# Altium project PD_SMARTKEY_EMN-EVAN_V2.0.PrjPcb
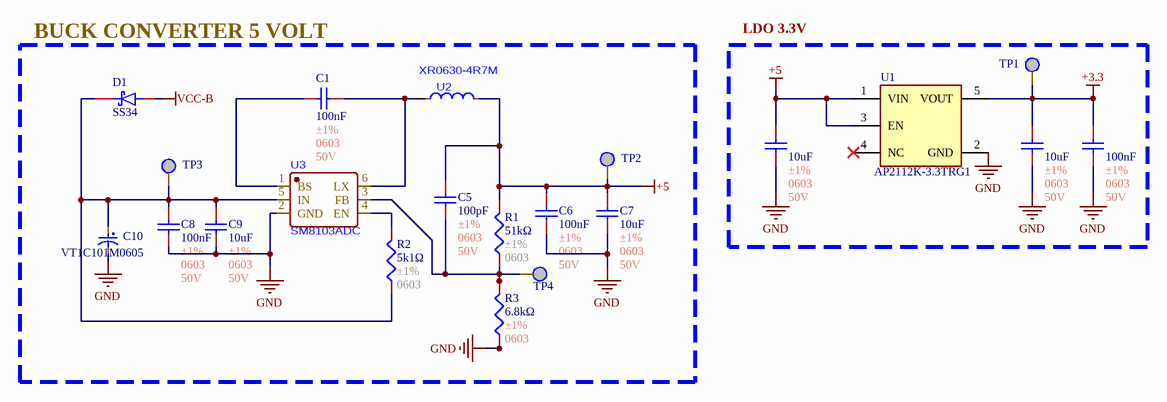
[diagram p0: Voltage Source.SchDoc]
4 sheets, 116 parts. Net scope: global (net labels, ports and power ports of the same name join across sheets).
Board file: PD_SMARTKEY_EMN-EVAN_V2.0.PcbDoc
Sheets:
  Voltage Source.SchDoc
  Micro Controller.SchDoc
  Peripheral.SchDoc
  Connector.SchDoc

## Sheet Voltage Source.SchDoc
size A4; SheetNumber: 3; SheetTotal: 6; ProjectTitle: PD_SMARTKEY_EMN-EVAN_V2

### Parts
C1  100nF  Tolerance: ±1%  Package: 0603  Voltage Rating: 50V  [C0603]
C2  10uF  Tolerance: ±1%  Package: 0603  Voltage Rating: 50V  [C0603]
C3  10uF  Tolerance: ±1%  Package: 0603  Voltage Rating: 50V  [C0603]
C4  100nF  Tolerance: ±1%  Package: 0603  Voltage Rating: 50V  [C0603]
C5  100pF  Tolerance: ±1%  Package: 0603  Voltage Rating: 50V  [C0603]
C6  100nF  Tolerance: ±1%  Package: 0603  Voltage Rating: 50V  [C0603]
C7  10uF  Tolerance: ±1%  Package: 0603  Voltage Rating: 50V  [C0603]
C8  100nF  Tolerance: ±1%  Package: 0603  Voltage Rating: 50V  [C0603]
C9  10uF  Tolerance: ±1%  Package: 0603  Voltage Rating: 50V  [C0603]
C10  VT1C101M0605  [C_100uF_16V_Aluminum]
D1  SS34  [SS34]
R1  51kΩ  Tolerance: ±1%  Package: 0603  [R0603]
R2  5k1Ω  Tolerance: ±1%  Package: 0603  [R0603]
R3  6.8kΩ  Tolerance: ±1%  Package: 0603  [R0603]
TP1  TP  [TP]  (value not drawn)
TP2  TP  [TP]  (value not drawn)
TP3  TP  [TP]  (value not drawn)
TP4  TP  [TP]  (value not drawn)
U1  AP2112K-3.3TRG1  [SOT23-5]
U2  XR0630-4R7M  [SMD,7x6.6mm]
U3  SM8103ADC  [TSOT-23-6]

### Blocks framed on the sheet
BUCK CONVERTER 5 VOLT: C1 C5-C10 D1 R1-R3 TP2-TP4 U2 U3
LDO 3.3V: C2-C4 TP1 U1

### Nets
+3.3: C3.1 C4.1 TP1.1 U1.5(VOUT)
+5: C2.1 C5.1 C6.1 C7.1 R1.2 TP2.1 U1.1(VIN) U1.3(EN) U2.2(F)
GND: C2.2 C3.2 C4.2 C6.2 C7.2 C8.2 C9.2 C10.2 R3.1 U1.2(GND) U3.2(GND)
VCC-B: D1.2
NetC1_1: C1.1 U2.1(S) U3.6(LX)
NetC1_2: C1.2 U3.1(BS)
NetC5_2: C5.2 R1.1 R3.2 TP4.1 U3.3(FB)
NetC8_1: C8.1 C9.1 C10.1 D1.1 R2.1 TP3.1 U3.5(IN)
NetR2_2: R2.2 U3.4(EN)

Not connected (* = marked no-connect by the designer): U1 4(NC)*

### Notes on the sheet
- Author:
- Title:
- Size:
- A4
- Project:
- Approved:
- Revision:
- Modified Date:
- CONFIDENTIAL
- Date:
- SW Version:

### Library data of the parts
C1 C6 C8 = C0603_100nF_±1%: Manufacturer: YAGEO; Mfr. Part #: CC0402FRNPO9BN100; LCSC Part #: C513681; Link: https://www.lcsc.com/product-detail/C513681.html?s_z=n_capital%2520yageo%252010pF%25200402; Capacitance: 100nF
C2 C3 = C0603_10uF_±1%: 50V 10pF NP0 ±1% 0402 Multilayer Ceramic Capacitors MLCC - SMD/SMT ROHS; Manufacturer: YAGEO; Mfr. Part #: CC0402FRNPO9BN100; LCSC Part #: C513681; Link: https://www.lcsc.com/product-detail/C513681.html?s_z=n_capital%2520yageo%252010pF%25200402; Capacitance: 10uF
C4 = C0603_100nF_±1%: 50V 10pF NP0 ±1% 0402 Multilayer Ceramic Capacitors MLCC - SMD/SMT ROHS; Manufacturer: YAGEO; Mfr. Part #: CC0402FRNPO9BN100; LCSC Part #: C513681; Link: https://www.lcsc.com/product-detail/C513681.html?s_z=n_capital%2520yageo%252010pF%25200402; Capacitance: 100nF
C5 = C0603_100pF_±1%: Manufacturer: YAGEO; Mfr. Part #: CC0402FRNPO9BN100; LCSC Part #: C513681; Link: https://www.lcsc.com/product-detail/C513681.html?s_z=n_capital%2520yageo%252010pF%25200402; Capacitance: 100pF
C7 C9 = C0603_10uF_±1%: Manufacturer: YAGEO; Mfr. Part #: CC0402FRNPO9BN100; LCSC Part #: C513681; Link: https://www.lcsc.com/product-detail/C513681.html?s_z=n_capital%2520yageo%252010pF%25200402; Capacitance: 10uF
C10 = C_100uF_16V_aluminum: 100uF 16V ±20% 63mA@120Hz SMD,D6.3xL5.4mm Aluminum Electrolytic Capacitors RoHS; Manufacturer: ROQANG; Key Attributes: CAP ALUM 100uF ±20% 16V SMD; Mfr. Part #: VT1C101M0605; LCSC Part #: C90273; Package: SMD,D6.3xL5.4mm; Link: https://www.lcsc.com/product-detail/C90273.html?s_z=n_capital%2520100uf%2520aluminum
D1 = SS34: 40V Independent 3A 550mV@3A SMA(DO-214AC) Schottky Diodes ROHS; Manufacturer: MDD(Microdiode Semiconductor); Mfr. Part #: SS34; LCSC Part #: C8678; Package: SMA(DO-214AC); Voltage - DC Reverse(Vr): 40V; Current - Rectified: 3A; Link: https://www.lcsc.com/product-detail/C8678.html?s_z=n_SS34
R1 = R0603_51kΩ_±1%: 100mW Thick Film Resistor 75V ±100ppm/℃ ±1% 51kΩ 0603 Chip Resistor - Surface Mount ROHS; Manufacturer: FOJAN; Mfr. Part #: FRC0603F5101TS; Key Attributes: RES 5.1kΩ ±1% 100mW 0603; LCSC Part #: C2907044; Link: https://www.lcsc.com/product-detail/C2907044.html?s_z=n_5k1%25200603; Resistance: 51kΩ
R2 = R0603_5k1Ω_±1%: 100mW Thick Film Resistor 75V ±100ppm/℃ ±1% 5.1kΩ 0603 Chip Resistor - Surface Mount ROHS; Manufacturer: FOJAN; Mfr. Part #: FRC0603F5101TS; Key Attributes: RES 5.1kΩ ±1% 100mW 0603; LCSC Part #: C2907044; Link: https://www.lcsc.com/product-detail/C2907044.html?s_z=n_5k1%25200603; Resistance: 5k1Ω
R3 = R0603_6.8kΩ_±1%_1: 6.8k; Manufacturer: YAGEO; Mfr. Part #: RC0402FR-0710RL; LCSC Part #: C138066; Resistance: 6.8kΩ; Link: https://www.lcsc.com/product-detail/C138066.html?s_z=n_resistor%25200402%252010R
U1 = AP2112K-3.3TRG1: Linear Voltage Regulator IC Positive Fixed 1 Output 600mA SOT23-5; MF: Diodes Inc.; Value: *; Purchase-URL: https://pricing.snapeda.com/search/part/AP2112K-3.3TRG1/?ref=eda; Package: SOT-753 Diodes Inc.; Availability: In Stock; Check_prices: https://www.snapeda.com/parts/AP2112K-3.3TRG1/Diodes+Inc./view-part/?ref=eda; Price: None; SnapEDA_Link: https://www.snapeda.com/parts/AP2112K-3.3TRG1/Diodes+Inc./view-part/?ref=snap; MP: AP2112K-3.3TRG1
U2 = FIXED IND 4.7uH 6A 33mΩ SMD,0630: Manufacturer: XR; MPN: XR0630-4R7M; LCSC Part #: C5307631; Packaging: SMD,7x6.6mm; Link: https://www.lcsc.com/product-detail/C5307631.html?s_z=n_q_t_INDUCTOR%25200630&spm=wm.fly.bg.0.xh___wm.ssy.tc.0.tz&lcsc_vid=FFlaVlZURFlbX1EAE1lbUlZfQwdeBlBRQ1VZBFdQQwUxVlNeRlRfU1ZRQlNZXzsOAxUeFF5JWBYZEEoKFBINSQcJGk4eFQsCAgIaSgADAwAHC0slQ1ZXV1NWWQkaCgg%3D
U3 = SM8103ADC: High Efficiency, 3.0A, 18V Input Synchronous Step Down Regulator; Manufacturer: Silergy; MPN: SM8103ADC; LCSC Part #: C479070; Packaging: TSOT-23-6; Link: https://www.lcsc.com/product-detail/C479070.html?s_z=s_p_SM8103ADC&spm=wm.fly.bg.0.xh&lcsc_vid=FFlaVlZURFlbX1EAE1lbUlZfQwdeBlBRQ1VZBFdQQwUxVlNeRlReUVRTQVFeUDsOAxUeFF5JWBYZEEoKFBINSQcJGk4dAgUUFAk%3D

## Sheet Micro Controller.SchDoc
size A4; SheetNumber: 4; SheetTotal: 6; ProjectTitle: PD_SMARTKEY_EMN-EVAN_V2
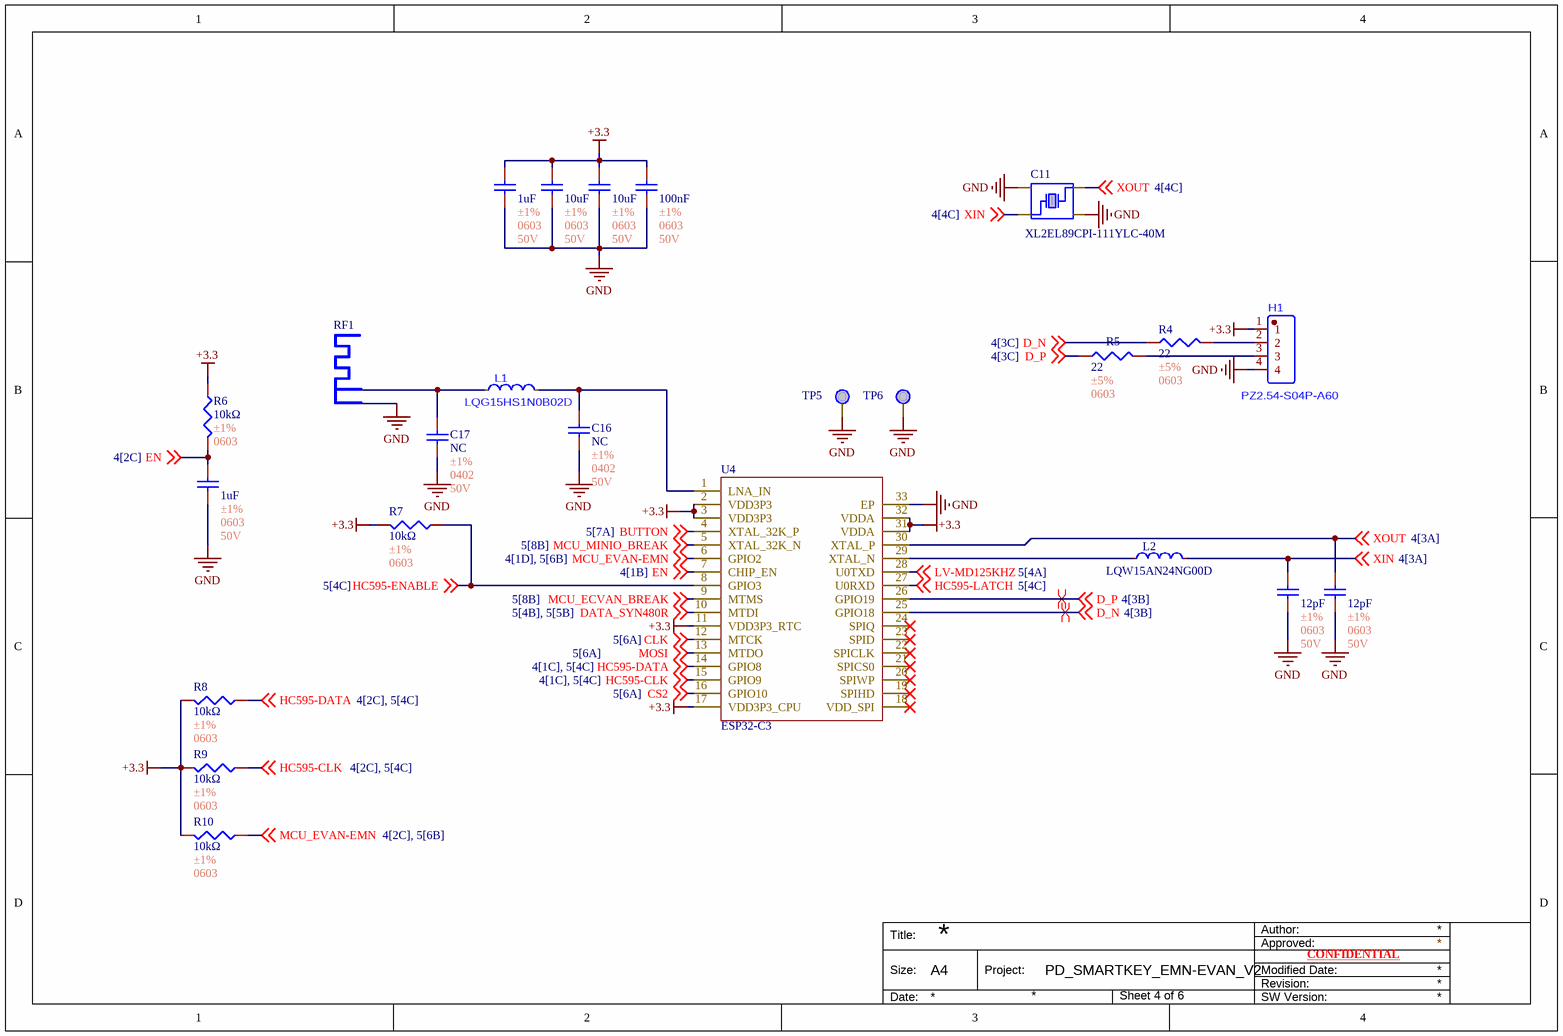
[diagram p1: Micro Controller.SchDoc]

### Parts
C11  XL2EL89CPI-111YLC-40M  [XL2EL89CPI-111YLC-40M]
C12  1uF  Tolerance: ±1%  Package: 0603  Voltage Rating: 50V  [C0603]
C13  10uF  Tolerance: ±1%  Package: 0603  Voltage Rating: 50V  [C0603]
C14  10uF  Tolerance: ±1%  Package: 0603  Voltage Rating: 50V  [C0603]
C15  100nF  Tolerance: ±1%  Package: 0603  Voltage Rating: 50V  [C0603]
C16  NC  Tolerance: ±1%  Package: 0402  Voltage Rating: 50V  [C0402]
C17  NC  Tolerance: ±1%  Package: 0402  Voltage Rating: 50V  [C0402]
C18  1uF  Tolerance: ±1%  Package: 0603  Voltage Rating: 50V  [C0603]
C19  12pF  Tolerance: ±1%  Package: 0603  Voltage Rating: 50V  [C0603]
C20  12pF  Tolerance: ±1%  Package: 0603  Voltage Rating: 50V  [C0603]
H1  PZ2.54-S04P-A60  [J_4P_XH2.54]
L1  LQG15HS1N0B02D  [L0402_1nH]
L2  LQW15AN24NG00D  [LQW15AN24NG00D]
R4  22  Tolerance: ±5%  Package: 0603  [R0603]
R5  22  Tolerance: ±5%  Package: 0603  [R0603]
R6  10kΩ  Tolerance: ±1%  Package: 0603  [R0603]
R7  10kΩ  Tolerance: ±1%  Package: 0603  [R0603]
R8  10kΩ  Tolerance: ±1%  Package: 0603  [R0603]
R9  10kΩ  Tolerance: ±1%  Package: 0603  [R0603]
R10  10kΩ  Tolerance: ±1%  Package: 0603  [R0603]
RF1  (no value)  [2.4GHZ-50OHMS_v1.1]
TP5  TP  [TP]  (value not drawn)
TP6  TP  [TP]  (value not drawn)
U4  ESP32-C3  [ESP32-C3]

### Nets
+3.3: C12.1 C13.1 C14.1 C15.1 H1.1 R6.1 R7.2 R8.2 R9.2 R10.2 U4.2(VDD3P3) U4.3(VDD3P3) U4.11(VDD3P3_RTC) U4.17(VDD3P3_CPU) U4.31(VDDA) U4.32(VDDA)
GND: C11.2 C11.4 C12.2 C13.2 C14.2 C15.2 C16.2 C17.2 C18.2 C19.2 C20.2 H1.4 RF1.2 TP5.1 TP6.1 U4.33(EP)
BUTTON: U4.4(XTAL_32K_P) ; off-sheet BUTTON
CLK: U4.12(MTCK) ; off-sheet CLK
CS2: U4.16(GPIO10) ; off-sheet CS2
D_N: R4.1 U4.25(GPIO18) ; off-sheet D_N
D_P: R5.1 U4.26(GPIO19) ; off-sheet D_P
DATA_SYN480R: U4.10(MTDI) ; off-sheet DATA_SYN480R
EN: C18.1 R6.2 U4.7(CHIP_EN) ; off-sheet EN
HC595-CLK: R9.1 U4.15(GPIO9) ; off-sheet HC595-CLK
HC595-DATA: R8.1 U4.14(GPIO8) ; off-sheet HC595-DATA
HC595-ENABLE: R7.1 U4.8(GPIO3) ; off-sheet HC595-ENABLE
HC595-LATCH: U4.27(U0RXD) ; off-sheet HC595-LATCH
LV-MD125KHZ: U4.28(U0TXD) ; off-sheet LV-MD125KHZ
MCU_ECVAN_BREAK: U4.9(MTMS) ; off-sheet MCU_ECVAN_BREAK
MCU_EVAN-EMN: R10.1 U4.6(GPIO2) ; off-sheet MCU_EVAN-EMN
MCU_MINIO_BREAK: U4.5(XTAL_32K_N) ; off-sheet MCU_MINIO_BREAK
MOSI: U4.13(MTDO) ; off-sheet MOSI
XIN: C11.1 C19.1 L2.2 ; off-sheet XIN
XOUT: C11.3 C20.1 U4.30(XTAL_P) ; off-sheet XOUT
NetC16_1: C16.1 L1.2 U4.1(LNA_IN)
NetC17_1: C17.1 L1.1 RF1.1
NetH1_2: H1.2 R4.2
NetH1_3: H1.3 R5.2
NetL2_1: L2.1 U4.29(XTAL_N)

Not connected (* = marked no-connect by the designer): U4 18(VDD_SPI)* 19(SPIHD)* 20(SPIWP)* 21(SPICS0)* 22(SPICLK)* 23(SPID)* 24(SPIQ)*

### Layout directives
differential pair: D_N, D_P

### Notes on the sheet
- Author:
- Title:
- Size:
- A4
- Project:
- Approved:
- Revision:
- Modified Date:
- CONFIDENTIAL
- Date:
- SW Version:

### Library data of the parts
C11 = XL2EL89CPI-111YLC-40M: Crystal Oscillator 15pF SMD3225-4P Crystals RoHS; Manufacturer: YXC Crystal Oscillators; Mfr. Part #: XL2EL89CPI-111YLC-40M; LCSC Part #: C5444549; Package: SMD3225-4P; Link: https://www.lcsc.com/product-detail/C5444549.html?s_z=n_oscillator; Key Attributes: Crystal Oscillator 15pF SMD3225-4P Crystals RoHS
C12 C18 = C0603_1uF_±1%: 50V 10pF NP0 ±1% 0402 Multilayer Ceramic Capacitors MLCC - SMD/SMT ROHS; Manufacturer: YAGEO; Mfr. Part #: CC0402FRNPO9BN100; LCSC Part #: C513681; Link: https://www.lcsc.com/product-detail/C513681.html?s_z=n_capital%2520yageo%252010pF%25200402; Capacitance: 1uF
C13 C14 = C0603_10uF_±1%: as C2 on sheet Voltage Source; LCSC Part #: C513681; Link: https://www.lcsc.com/product-detail/C513681.html?s_z=n_capital%2520yageo%252010pF%25200402; Capacitance: 10uF
C15 = C0603_100nF_±1%: as C4 on sheet Voltage Source; LCSC Part #: C513681; Link: https://www.lcsc.com/product-detail/C513681.html?s_z=n_capital%2520yageo%252010pF%25200402; Capacitance: 100nF
C16 C17 = C0402_NC_±1%: Manufacturer: YAGEO; Mfr. Part #: CC0402FRNPO9BN100; Capacitance: 1uF; LCSC Part #: C513681; Link: https://www.lcsc.com/product-detail/C513681.html?s_z=n_capital%2520yageo%252010pF%25200402
C19 C20 = C0603_12pF_±1%: 50V 10pF NP0 ±1% 0402 Multilayer Ceramic Capacitors MLCC - SMD/SMT ROHS; Manufacturer: YAGEO; Mfr. Part #: CC0402FRNPO9BN100; LCSC Part #: C513681; Link: https://www.lcsc.com/product-detail/C513681.html?s_z=n_capital%2520yageo%252010pF%25200402; Capacitance: 12pF
H1 = J_4P_XH2.54: 1kV 1 2.54mm Pin Header 3A 2.5mm Through Hole 6mm -40℃~+105℃ 3mm Gold 4P Black 1x4P Through Hole,P=2.54mm Headers, Male Pins RoHS; Manufacturer: JXTCONN; MPN: PZ2.54-S04P-A60; LCSC Part #: C42431795; Packaging: Through Hole,P=2.54mm; Link: https://www.lcsc.com/product-detail/C42431795.html?s_z=n_q_t_header%25204%2520p&spm=wm.fly.bg.0.xh___wm.ssy.tc.0.tz&lcsc_vid=FlRcBlcDRFNZAlJQT1RZBVJSEVFcX11eRVQPBFEHFgAxVlNeQVVcV1RRRlFeUzsOAxUeFF5JWBYZEEoKFBINSQcJGk4dAgUUFAk%3D
L1 = L0402_1nH: FIXED IND 1nH 1A 70mΩ 0402; Manufacturer: muRata; MPN: LQG15HS1N0B02D; LCSC Part #: C162538; Packaging: 0402; Link: https://www.lcsc.com/product-detail/C162538.html?s_z=n_q_0402%2520inductor%25201nH&spm=wm.fly.bg.1.xh&lcsc_vid=FFlaVlZURFlbX1EAE1lbUlZfQwdeBlBRQ1VZBFdQQwUxVlNeQ1FfVlBVRFlZVjsOAxUeFF5JWBYZEEoKFBINSQcJGk4NBhADEA4cHktXRllfSQwSGg0%3D
L2 = LQW15AN24NG00D: FIXED IND 24nH 280mA 520mΩ 0402; Manufacturer: muRata; Mfr. Part #: LQW15AN24NG00D; LCSC Part #: C167472; Package: 0402; Link: https://www.lcsc.com/product-detail/C167472.html?s_z=n_q_inductor%252024nH%25200402&spm=wm.fly.bg.0.xh&lcsc_vid=FlRcBlcDRFNZAlJQT1RZBVJSEVFcX11eRVQPBFEHFgAxVlNeQVRfUFJVQVNZUzsOAxUeFF5JWBYZEEoKFBINSQcJGk4eFQsCAgIaSgADAwAHC0slRlhdU1RSWQkaCgg%3D
R4 R5 = R0603_0Ω_±5%: 100mW Thick Film Resistor 75V ±5% 0Ω 0603 Chip Resistor - Surface Mount ROHS; Manufacturer: YAGEO; Mfr. Part #: RC0603JR-070RL; Key Attributes: RES 0Ω ±5% 100mW 0603; LCSC Part #: C95177; Resistance: 0Ω; Link: https://www.lcsc.com/product-detail/C138066.html?s_z=n_resistor%25200402%252010R
R6-R10 = R0603_10kΩ_±1%: 62.5mW Thick Film Resistor 50V ±1% ±200ppm/℃ 10Ω 0402 Chip Resistor - Surface Mount ROHS; Manufacturer: YAGEO; Mfr. Part #: RC0402FR-0710RL; LCSC Part #: C138066; Resistance: 10kΩ; Link: https://www.lcsc.com/product-detail/C138066.html?s_z=n_resistor%25200402%252010R
RF1 = Antenna
U4 = ESP32-C3: Others 160MHz QFN-32-EP(5x5) RF Transceiver Modules and Modems RoHS; Manufacturer: ESPRESSIF; LCSC Part #: C2838500; Package: QFN-32-EP(5x5); Link: https://www.lcsc.com/product-detail/C2838500.html?s_z=n_ESP32%2520C3; MPN: ESP32-C3

## Sheet Peripheral.SchDoc
size A3; SheetNumber: 5; SheetTotal: 6; ProjectTitle: PD_SMARTKEY_EMN-EVAN_V2
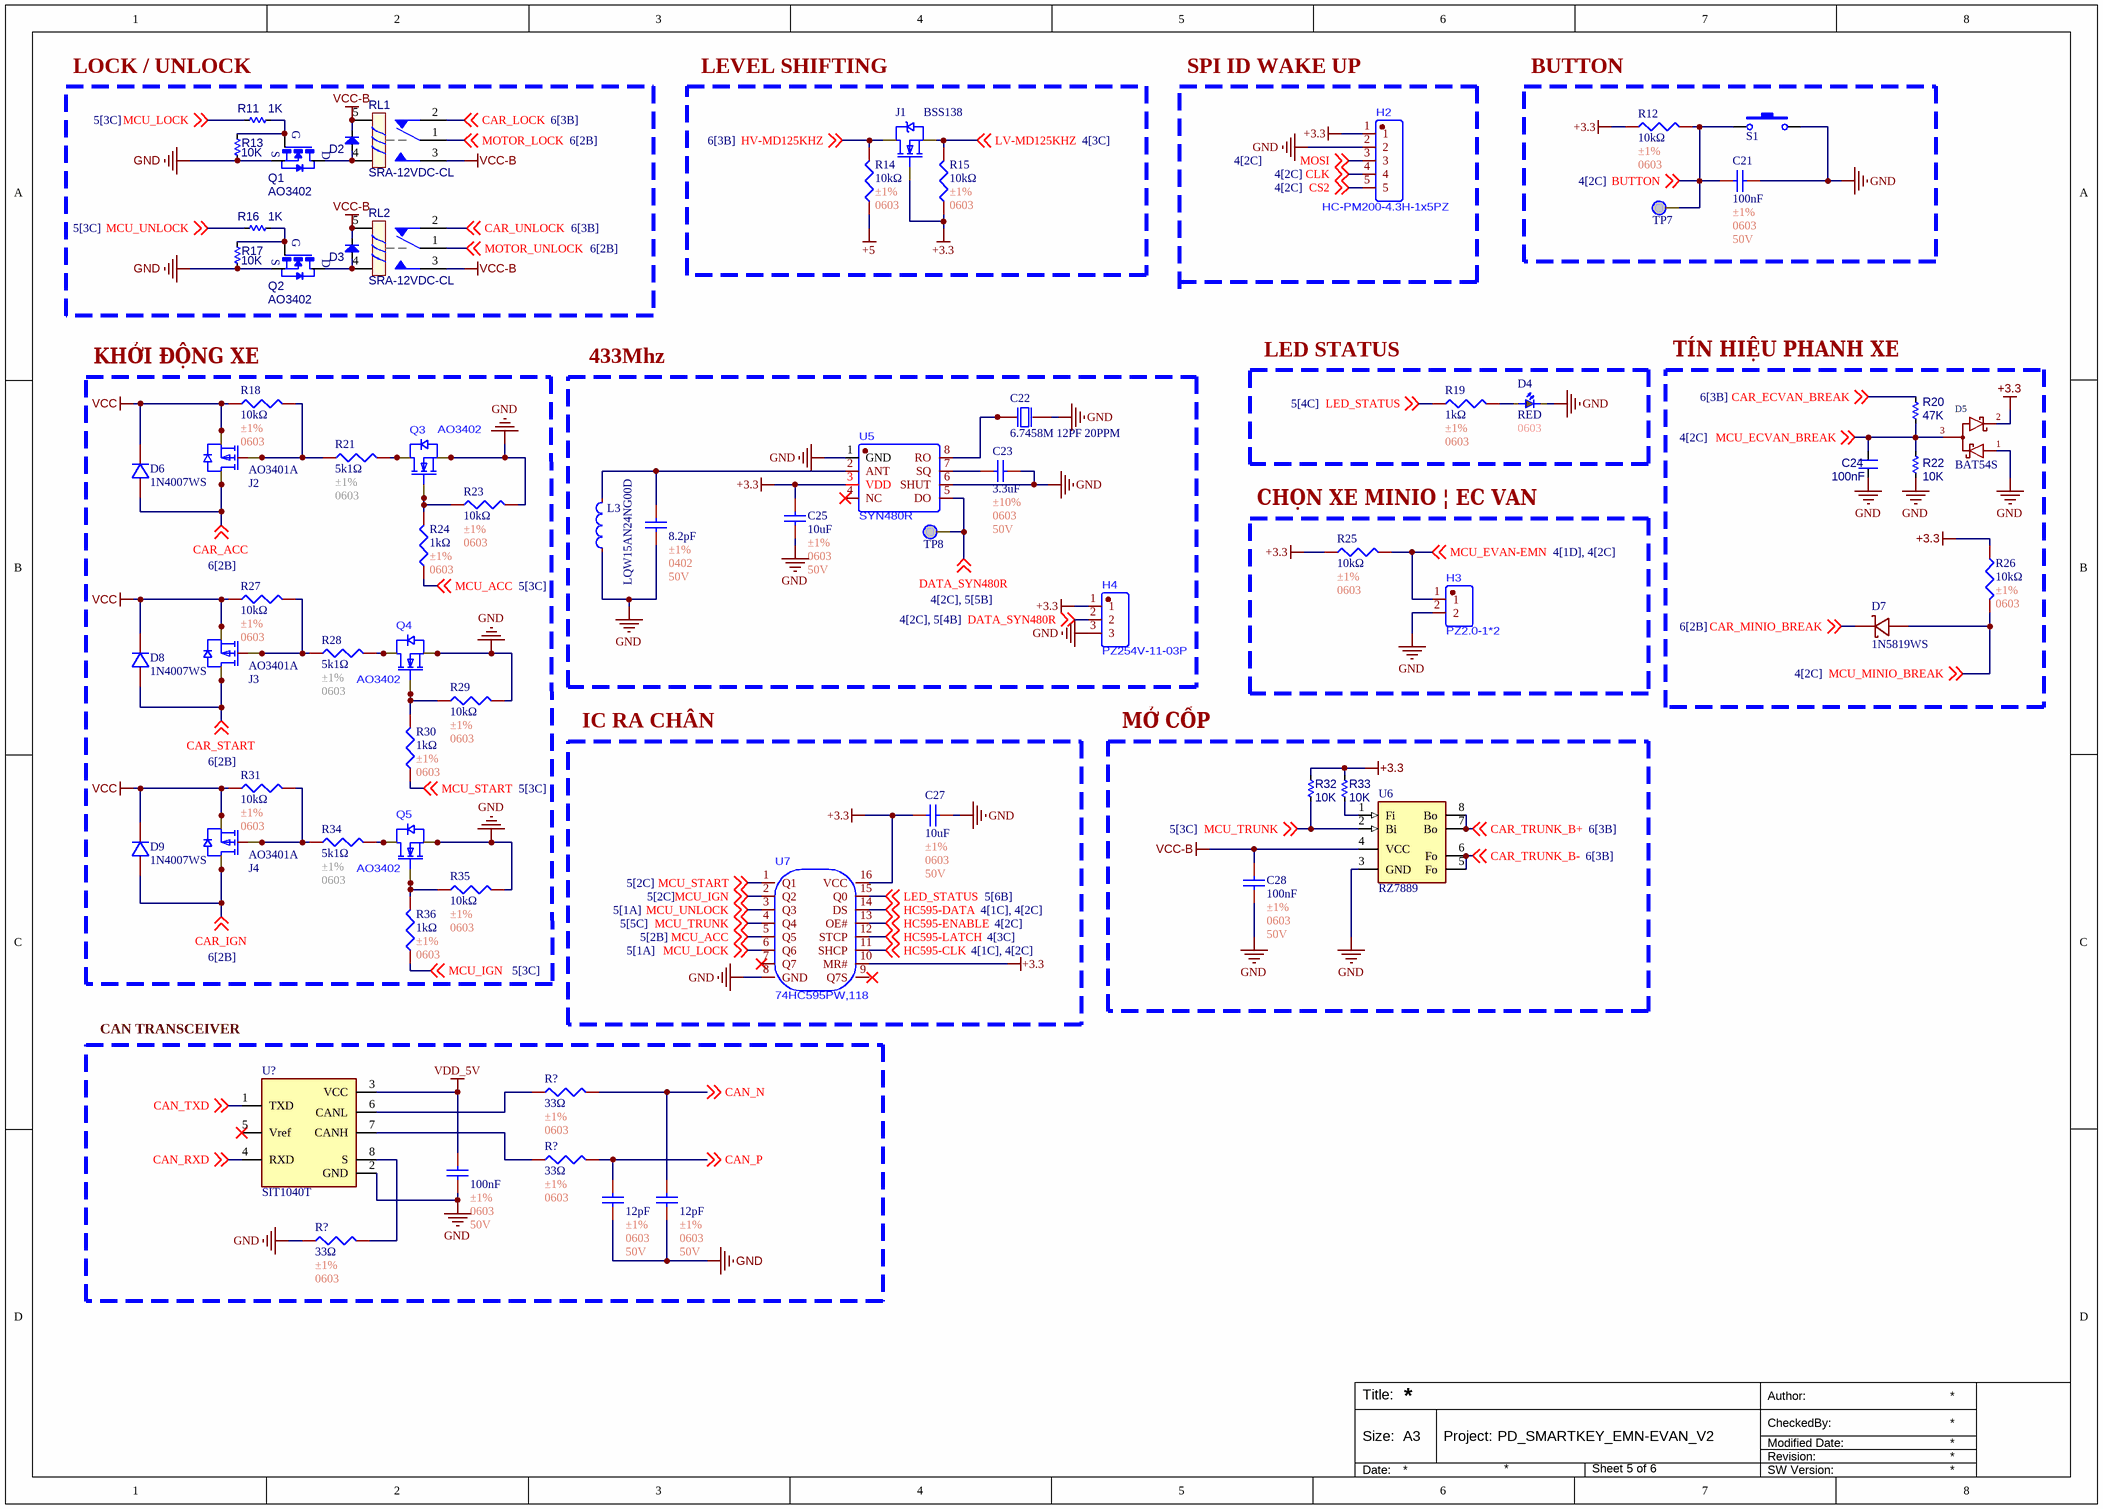
[diagram p2: Peripheral.SchDoc]

### Parts
(Parts that share a designator on the sheet are numbered #1, #2 ... from top to bottom, then left to right.)
C21  100nF  Tolerance: ±1%  Package: 0603  Voltage Rating: 50V  [C0603]
C22  6.7458M 12PF 20PPM  [6.7458M 12PF 20PPM]
C23  3.3uF  Tolerance: ±10%  Package: 0603  Voltage Rating: 50V  [C0603]
C24  100nF  [C-0603]
C25  10uF  Tolerance: ±1%  Package: 0603  Voltage Rating: 50V  [C0603]
C26  8.2pF  Tolerance: ±1%  Package: 0402  Voltage Rating: 50V  [C0402]
C27  10uF  Tolerance: ±1%  Package: 0603  Voltage Rating: 50V  [C0603]
C28  100nF  Tolerance: ±1%  Package: 0603  Voltage Rating: 50V  [C0603]
C?#1  100nF  Tolerance: ±1%  Package: 0603  Voltage Rating: 50V  [C0603]
C?#2  12pF  Tolerance: ±1%  Package: 0603  Voltage Rating: 50V  [C0603]
C?#3  12pF  Tolerance: ±1%  Package: 0603  Voltage Rating: 50V  [C0603]
D2  1N5819  [SOD-323]  (value not drawn)
D3  1N5819  [SOD-323]  (value not drawn)
D4  RED  Package: 0603  [LED0603]
D5  BAT54S  [SOT23-3]
D6  1N4007WS  [1N4007WS]
D7  1N5819WS  [1N5819WS]
D8  1N4007WS  [1N4007WS]
D9  1N4007WS  [1N4007WS]
H2  HC-PM200-4.3H-1x5PZ  [JC_5P_XH2.0]
H3  PZ2.0-1*2  [JC_2P_XH2.0]
H4  PZ254V-11-03P  [PZ254V-11-03P]
J1  BSS138  [BSS138]
J2  AO3401A  [AO3401]
J3  AO3401A  [AO3401]
J4  AO3401A  [AO3401]
L3  LQW15AN24NG00D  [LQW15AN24NG00D]
Q1  AO3402  [SOT23-3]
Q2  AO3402  [SOT23-3]
Q3  AO3402  [AO3402]
Q4  AO3402  [AO3402]
Q5  AO3402  [AO3402]
R11  1K  [RES-SMD-0603]
R12  10kΩ  Tolerance: ±1%  Package: 0603  [R0603]
R13  10K  [RES-SMD-0603]
R14  10kΩ  Tolerance: ±1%  Package: 0603  [R0603]
R15  10kΩ  Tolerance: ±1%  Package: 0603  [R0603]
R16  1K  [RES-SMD-0603]
R17  10K  [RES-SMD-0603]
R18  10kΩ  Tolerance: ±1%  Package: 0603  [R0603]
R19  1kΩ  Tolerance: ±1%  Package: 0603  [R0603]
R20  47K  [RES-SMD-0603]
R21  5k1Ω  Tolerance: ±1%  Package: 0603  [R0603]
R22  10K  [RES-SMD-0603]
R23  10kΩ  Tolerance: ±1%  Package: 0603  [R0603]
R24  1kΩ  Tolerance: ±1%  Package: 0603  [R0603]
R25  10kΩ  Tolerance: ±1%  Package: 0603  [R0603]
R26  10kΩ  Tolerance: ±1%  Package: 0603  [R0603]
R27  10kΩ  Tolerance: ±1%  Package: 0603  [R0603]
R28  5k1Ω  Tolerance: ±1%  Package: 0603  [R0603]
R29  10kΩ  Tolerance: ±1%  Package: 0603  [R0603]
R30  1kΩ  Tolerance: ±1%  Package: 0603  [R0603]
R31  10kΩ  Tolerance: ±1%  Package: 0603  [R0603]
R32  10K  [RES-SMD-0603]
R33  10K  [RES-SMD-0603]
R34  5k1Ω  Tolerance: ±1%  Package: 0603  [R0603]
R35  10kΩ  Tolerance: ±1%  Package: 0603  [R0603]
R36  1kΩ  Tolerance: ±1%  Package: 0603  [R0603]
R?#1  33Ω  Tolerance: ±1%  Package: 0603  [R0603]
R?#2  33Ω  Tolerance: ±1%  Package: 0603  [R0603]
R?#3  33Ω  Tolerance: ±1%  Package: 0603  [R0603]
RL1  SRA-12VDC-CL  [YL318-DC12V-C]
RL2  SRA-12VDC-CL  [YL318-DC12V-C]
S1  SW-SMD  [SW-SMD]  (value not drawn)
TP7  TP  [TP]  (value not drawn)
TP8  TP  [TP]  (value not drawn)
U5  SYN480R  [SYN480R]
U6  RZ7889  [SO8]
U7  74HC595PW,118  [74HC595PW,118]
U?  SIT1040T  [SO8]

### Blocks framed on the sheet
LOCK / UNLOCK: D2 D3 Q1 Q2 R11 R13 R16 R17 RL1 RL2
LEVEL SHIFTING: J1 R14 R15
BUTTON: C21 R12 S1 TP7
KHỞI ĐỘNG XE: D6 D8 D9 J2-J4 Q3-Q5 R18 R21 R23 R24 R27-R31 R34-R36
433Mhz: C22 C23 C25 C26 H4 L3 TP8 U5
TÍN HIỆU PHANH XE: C24 D5 D7 R20 R22 R26
CHỌN XE MINIO | EC VAN: H3 R25
IC RA CHÂN: C27 U7
MỞ CỐP: C28 R32 R33 U6
CAN TRANSCEIVER: C?#1-C?#3 R?#1-R?#3 U?

### Nets
+3.3: C25.1 C27.1 D5.2(C) H2.1 H4.1 J1.1(G) R12.1 R15.1 R25.1 R26.1 R32.1 R33.1 U5.3(VDD) U7.10(MR#) U7.16(VCC)
+5: R14.1
GND: C21.1 C22.2(OSC2) C23.1 C24.1 C25.2 C26.2 C27.2 C28.2 C?#1.2 C?#2.2 C?#3.2 D4.1 D5.1(A) H2.2 H3.2 H4.3 L3.1 Q1.2(S) Q2.2(S) Q3.2(S) Q4.2(S) Q5.2(S) R13.1 R17.1 R22.1 R23.2 R29.2 R35.2 R?#3.1 S1.2 U5.1(GND) U5.6(SHUT) U6.3(GND) U7.8(GND) U?.2(GND)
VCC: D6.1(K) D8.1(K) D9.1(K) J2.2(S) J3.2(S) J4.2(S) R18.1 R27.1 R31.1
VCC-B: C28.1 D2.2(K) D3.2(K) RL1.3 RL1.5 RL2.3 RL2.5 U6.4(VCC)
VDD_5V: C?#1.1 U?.3(VCC)
BUTTON: C21.2 R12.2 S1.1 TP7.1 ; off-sheet BUTTON
CAN_N: C?#3.1 R?#1.2 ; off-sheet CAN_N
CAN_P: C?#2.1 R?#2.2 ; off-sheet CAN_P
CAN_RXD: U?.4(RXD) ; off-sheet CAN_RXD
CAN_TXD: U?.1(TXD) ; off-sheet CAN_TXD
CAR_ACC: D6.2(A) J2.3(D) ; off-sheet CAR_ACC
CAR_ECVAN_BREAK: R20.2 ; off-sheet CAR_ECVAN_BREAK
CAR_IGN: D9.2(A) J4.3(D) ; off-sheet CAR_IGN
CAR_LOCK: RL1.2 ; off-sheet CAR_LOCK
CAR_MINIO_BREAK: D7.1(K) ; off-sheet CAR_MINIO_BREAK
CAR_START: D8.2(A) J3.3(D) ; off-sheet CAR_START
CAR_TRUNK_B+: U6.7(Bo) U6.8(Bo) ; off-sheet CAR_TRUNK_B+
CAR_TRUNK_B-: U6.5(Fo) U6.6(Fo) ; off-sheet CAR_TRUNK_B-
CAR_UNLOCK: RL2.2 ; off-sheet CAR_UNLOCK
CLK: H2.4 ; off-sheet CLK
CS2: H2.5 ; off-sheet CS2
DATA_SYN480R: H4.2 TP8.1 U5.5(DO) ; off-sheet DATA_SYN480R
HC595-CLK: U7.11(SHCP) ; off-sheet HC595-CLK
HC595-DATA: U7.14(DS) ; off-sheet HC595-DATA
HC595-ENABLE: U7.13(OE#) ; off-sheet HC595-ENABLE
HC595-LATCH: U7.12(STCP) ; off-sheet HC595-LATCH
HV-MD125KHZ: J1.3(D) R14.2 ; off-sheet HV-MD125KHZ
LED_STATUS: R19.1 U7.15(Q0) ; off-sheet LED_STATUS
LV-MD125KHZ: J1.2(S) R15.2 ; off-sheet LV-MD125KHZ
MCU_ACC: R24.1 U7.5(Q5) ; off-sheet MCU_ACC
MCU_ECVAN_BREAK: C24.2 D5.3 R20.1 R22.2 ; off-sheet MCU_ECVAN_BREAK
MCU_EVAN-EMN: H3.1 R25.2 ; off-sheet MCU_EVAN-EMN
MCU_IGN: R36.1 U7.2(Q2) ; off-sheet MCU_IGN
MCU_LOCK: R11.2 U7.6(Q6) ; off-sheet MCU_LOCK
MCU_MINIO_BREAK: D7.2(A) R26.2 ; off-sheet MCU_MINIO_BREAK
MCU_START: R30.1 U7.1(Q1) ; off-sheet MCU_START
MCU_TRUNK: R32.2 U6.2(Bi) U7.4(Q4) ; off-sheet MCU_TRUNK
MCU_UNLOCK: R16.2 U7.3(Q3) ; off-sheet MCU_UNLOCK
MOSI: H2.3 ; off-sheet MOSI
MOTOR_LOCK: RL1.1 ; off-sheet MOTOR_LOCK
MOTOR_UNLOCK: RL2.1 ; off-sheet MOTOR_UNLOCK
NetC22_1: C22.1(OSC1) U5.8(RO)
NetC23_2: C23.2 U5.7(SQ)
NetC26_1: C26.1 L3.2 U5.2(ANT)
NetD2_1: D2.1(A) Q1.3(D) RL1.4
NetD3_1: D3.1(A) Q2.3(D) RL2.4
NetD4_2: D4.2 R19.2
NetJ2_1: J2.1(G) R18.2 R21.1
NetJ3_1: J3.1(G) R27.2 R28.1
NetJ4_1: J4.1(G) R31.2 R34.1
NetQ1_1: Q1.1(G) R11.1 R13.2
NetQ2_1: Q2.1(G) R16.1 R17.2
NetQ3_1: Q3.1(G) R23.1 R24.2
NetQ3_3: Q3.3(D) R21.2
NetQ4_1: Q4.1(G) R29.1 R30.2
NetQ4_3: Q4.3(D) R28.2
NetQ5_1: Q5.1(G) R35.1 R36.2
NetQ5_3: Q5.3(D) R34.2
NetR33_2: R33.2 U6.1(Fi)
NetR?#1_1: R?#1.1 U?.6(CANL)
NetR?#2_1: R?#2.1 U?.7(CANH)
NetR?#3_2: R?#3.2 U?.8(S)

Not connected (* = marked no-connect by the designer): U5 4(NC)*; U7 7(Q7)* 9(Q7S); U? 5(Vref)*

### Notes on the sheet
- SPI ID WAKE UP
- LED STATUS
- Author:
- Title:
- Size:
- A3
- Project:
- Revision:
- Modified Date:
- CheckedBy:
- Date:
- SW Version:

### Library data of the parts
C21 C28 = C0603_100nF_±1%: as C1 on sheet Voltage Source; LCSC Part #: C513681; Link: https://www.lcsc.com/product-detail/C513681.html?s_z=n_capital%2520yageo%252010pF%25200402; Capacitance: 100nF
C22 = 6.7458M 12PF 20PPM: CRYSTAL 6.7458MHz 12pF SMD; Manufacturer: SOSET; Load Capacitance: 20pF; Mfr. Part #: 6.7458M 12PF 20PPM; LCSC Part #: C4944008; Package: HC-49S-SMD-2P-Mini; Link: https://www.lcsc.com/product-detail/C4944008.html?utm_source=chatgpt.com
C23 = C0603_3.3uF_±10%: Manufacturer: muRata; Mfr. Part #: GCJ188C70J335KE02D; Temperature Coefficient: X7S; LCSC Part #: C710616; Link: https://www.lcsc.com/product-detail/C710616.html?s_z=n_Capita%25200603%25203.3uF%2520yageo; Capacitance: 3.3uF
C24 = CM: Cap SMD; Value: 103
C25 C27 = C0603_10uF_±1%: as C7 on sheet Voltage Source; LCSC Part #: C513681; Link: https://www.lcsc.com/product-detail/C513681.html?s_z=n_capital%2520yageo%252010pF%25200402; Capacitance: 10uF
C26 = C0402_10pF_±1%: 50V 10pF NP0 ±1% 0402 Multilayer Ceramic Capacitors MLCC - SMD/SMT ROHS; Manufacturer: YAGEO; Mfr. Part #: CC0402FRNPO9BN100; LCSC Part #: C513681; Link: https://www.lcsc.com/product-detail/C513681.html?s_z=n_capital%2520yageo%252010pF%25200402; Capacitance: 10pF
C?#1 = C0603_100nF_±1%: as C4 on sheet Voltage Source; LCSC Part #: C513681; Link: https://www.lcsc.com/product-detail/C513681.html?s_z=n_capital%2520yageo%252010pF%25200402; Capacitance: 100nF
C?#2 C?#3 = C0603_12pF_±1%: as C19 on sheet Micro Controller; LCSC Part #: C513681; Link: https://www.lcsc.com/product-detail/C513681.html?s_z=n_capital%2520yageo%252010pF%25200402; Capacitance: 12pF
D2 D3 = Diode SMD: Default Diode; Code - JEDEC: DO-214-AB; Value: 1N5007; Published: 8-Jun-2000; Revision: July-2002: Re-released for DXP Platform.; Publisher: Altium Limited
D4 = D0603_RED: 25mcd~40mcd Water Clear -40℃~+85℃ 624nm Red 120° 60mW 0402 LED Indication - Discrete ROHS; Manufacturer: XINGLIGHT; Mfr. Part #: XL-1005UGC; Voltage - Forward(Vf): 3V; LCSC Part #: C965793; Power(Watts): 60mW; Link: https://www.lcsc.com/product-detail/C136765.html?s_z=n_LED%25200402%2520RED; Illumination Color: RED
D5 = Schottky Dual Diode SMD: Diode 30V 0.2A Surface Mount SOT-23; ki_keywords: Dual Schottky Diode Series; ki_description: Dual Schottky Diode in Series; Datasheet: https://diotec.com/request/datasheet/bat54.pdf
D6 D8 D9 = 1N4007WS: DIODE STANDARD 1kV 1A SOD-323; Manufacturer: MDD(Microdiode Semiconductor); Mfr. Part #: 1N4007WS; LCSC Part #: C193404; Package: SOD-323; Link: https://www.lcsc.com/product-detail/C193404.html?utm_source=chatgpt.com
D7 = 1N5819WS: DIODE SCHOTTKY 40V SOD-323; Manufacturer: Guangdong Hottech; Mfr. Part #: 1N5819WS; LCSC Part #: SOD-323; Package: SOD-323; Link: https://www.lcsc.com/product-detail/C191023.html?s_z=n_q_t_1n5819&spm=wm.fly.bg.0.xh___wm.ssy.tc.0.tz&lcsc_vid=FFlaVlZURFlbX1EAE1lbUlZfQwdeBlBRQ1VZBFdQQwUxVlNeQ1RdUFFfRVVZVDsOAxUeFF5JWBYZEEoKFBINSQcJGk4eFQsCAgIaSgADAwAHC0slRFJfVVJQRE8GEwkK
H2 = JC_5P_XH2.0X_: CONN SOCKET 5POS 2mm SINGLE ROW TH; Manufacturer: Hong Cheng; MPN: HC-PM200-4.3H-1x5PZ; LCSC Part #: C22436139; Packaging: Through Hole,P=2mm; Link: https://www.lcsc.com/product-detail/C22436139.html?utm_source=chatgpt.com
H3 = JC_2P_XH2.54: CONN HEADER 2POS 2mm SINGLE ROW TH; Manufacturer: ZHOURI; MPN: PZ2.0-1*2; LCSC Part #: C5224022; Packaging: Through Hole,P=2mm; Link: https://www.lcsc.com/product-detail/C5224022.html?utm_source=chatgpt.com
H4 = PZ254V-11-03P: CONN HEADER 3POS 2.54mm SINGLE ROW TH; Manufacturer: XFCN; MPN: PZ254V-11-03P; LCSC Part #: C2937625; Packaging: Through Hole,P=2.54mm; Link: https://www.lcsc.com/product-detail/C2937625.html?s_z=n_q_t_header%25203%2520Position&spm=wm.fly.bg.3.xh___wm.ssy.tc.0.tz&lcsc_vid=FlRcBlcDRFNZAlJQT1RZBVJSEVFcX11eRVQPBFEHFgAxVlNeQVVaV1BSRFVfXjsOAxUeFF5JWBYZEEoKFBINSQcJGk4dAgUUFAk%3D
J1 = BSS138: MOSFET N-CH 50V 0.22A SOT-23; Manufacturer: onsemi; Mfr. Part #: BSS138; LCSC Part #: C52895; Package: SOT-23; Link: https://www.lcsc.com/product-detail/C52895.html?s_z=n_q_x_bss138&spm=wm.ssy.em.0.tz&lcsc_vid=FFlaVlZURFlbX1EAE1lbUlZfQwdeBlBRQ1VZBFdQQwUxVlNeQlVeVVZeQlBWUTsOAxUeFF5JWBYZEEoKFBINSQcJGk4eFQsCAgIaSgADAwAHC0slTlBeX1dIHxUDCw%3D%3D
J2-J4 = AO3401: 30V 4A 900mV@250uA 1 P-Channel SOT-23 MOSFETs ROHS; Manufacturer: AOS; Mfr. Part #: AO3401A; LCSC Part #: C15127; Package: SOT-23; Current - Continuous Drain(Id): 4A; Drain to Source Voltage: 30V; Link: https://www.lcsc.com/product-detail/C15127.html?s_z=n_AO3401
L3 = LQW15AN24NG00D: as L2 on sheet Micro Controller; Mfr. Part #: LQW15AN24NG00D; LCSC Part #: C167472; Package: 0402; Link: https://www.lcsc.com/product-detail/C167472.html?s_z=n_q_inductor%252024nH%25200402&spm=wm.fly.bg.0.xh&lcsc_vid=FlRcBlcDRFNZAlJQT1RZBVJSEVFcX11eRVQPBFEHFgAxVlNeQVRfUFJVQVNZUzsOAxUeFF5JWBYZEEoKFBINSQcJGk4eFQsCAgIaSgADAwAHC0slRlhdU1RSWQkaCgg%3D
Q1 Q2 = SI2302DS: N-Channel 20V 2.5A _Tc_ 830mW _Tc_ Surface Mount TO-236AB _SOT23_; MF: NXP Semiconductors; SnapEDA_Link: https://www.snapeda.com/parts/SI2302DS/NXP%20Semiconductors/view-part/4701514/?ref=snap; Availability: Unavailable; MP: SI2302DS; Price: None; Value: *; Package: None
Q3-Q5 = AO3402: MOSFET N-CH 30V SOT-23; Manufacturer: AOS; MPN: AO3402; LCSC Part #: C14385; Packaging: SOT-23; Link: https://www.lcsc.com/product-detail/C14385.html?s_z=n_q_ao3402&spm=wm.fly.bg.0.xh&lcsc_vid=FFlaVlZURFlbX1EAE1lbUlZfQwdeBlBRQ1VZBFdQQwUxVlNeRVZXVF1QQ1BYXzsOAxUeFF5JWBYZEEoKFBINSQcJGk4NBhADEA4cHktXR1FWSQwSGg0%3D
R11 R13 R16 R17 R20 R22 R32 R33 = Res-SMD: Resistor; Manufacturer: Generic Components; Class: Passive; Published: 08/06/2000; Publisher: Altium Hobart Technology Centre
R12 R14 R15 R18 R23 R25-R27 R29 R31 R35 = R0603_10kΩ_±1%: as R6 on sheet Micro Controller; LCSC Part #: C138066; Resistance: 10kΩ; Link: https://www.lcsc.com/product-detail/C138066.html?s_z=n_resistor%25200402%252010R
R19 R24 R30 R36 = R0603_1kΩ_±1%: 62.5mW Thick Film Resistor 50V ±1% ±200ppm/℃ 10Ω 0402 Chip Resistor - Surface Mount ROHS; Manufacturer: YAGEO; Mfr. Part #: RC0402FR-0710RL; LCSC Part #: C138066; Resistance: 1kΩ; Link: https://www.lcsc.com/product-detail/C138066.html?s_z=n_resistor%25200402%252010R
R21 R28 R34 = R0603_5k1Ω_±1%: as R2 on sheet Voltage Source; LCSC Part #: C2907044; Link: https://www.lcsc.com/product-detail/C2907044.html?s_z=n_5k1%25200603; Resistance: 5k1Ω
R?#1-R?#3 = R0603_33Ω_±5%: 100mW Thick Film Resistor 75V ±1% ±200ppm/℃ 2Ω 0603 Chip Resistor - Surface Mount ROHS; Manufacturer: YAGEO; Mfr. Part #: RC0603FR-072RL; Key Attributes: RES 0Ω ±5% 100mW 0603; LCSC Part #: C185341; Resistance: 33Ω; Link: https://www.lcsc.com/product-detail/C185341.html?s_z=n_resistor%2520yageo%25202%25CE%25A9%25200603
RL1 RL2 = Relay 1: Relay SPDT,10A - 12VDC 5 Pin; Value: Relay SPDT, 10A, 12V
S1 = SW-SMD: Switch; Published: 24-Mar-1999; LatestRevisionDate: 17-Jul-2002; LatestRevisionNote: Re-released for DXP Platform.; PackageReference: SPST-2; Publisher: Altium Limited
U5 = SYN480R: 433/315 MHz wireless receiver chips; Manufacturer: JSMSEMI; MPN: SYN480R; LCSC Part #: C916347; Packaging: SOP-8; Link: https://www.lcsc.com/product-detail/C916347.html?s_z=n_q_SYN480R&spm=wm.fly.bg.0.xh&lcsc_vid=FlRcBlcDRFNZAlJQT1RZBVJSEVFcX11eRVQPBFEHFgAxVlNeQVVdUFxQR1VXUDsOAxUeFF5JWBYZEEoKFBINSQcJGk4eFQsCAgIaSgADAwAHC0sRHhMLShAJWgMBBhYCWgIBCQoDFBUBFTsLEgYPFBAHBUwUH0kODlNDV0lVBxYaOCdRQ1NXUlNWWQkaCgg%3D
U6 = RZ7889: RZ7889 is a monolithic IC designed for driving bi-directional DC motor
U7 = 74HC595PW,118: 8-bit serial-in, serial or parallel-out shift register with output latches; 3-state; Manufacturer: Nexperia; MPN: 74HC595PW,118; LCSC Part #: C5948; Packaging: TSSOP-16; Link: https://www.lcsc.com/product-detail/C5948.html?utm_source=chatgpt.com
U? = TJA1050: 1/1 Transceiver Half CANbus 8-SO; MF: NXP USA; Package: SOIC-8 NXP USA; Value: *; Availability: Unavailable; SnapEDA_Link: https://www.snapeda.com/parts/TJA1050/NXP%20USA%20Inc./view-part/562764/?ref=snap; Price: None; MP: TJA1050

## Sheet Connector.SchDoc
size A4; SheetNumber: 6; SheetTotal: 6; ProjectTitle: PD_SMARTKEY_EMN-EVAN_V2
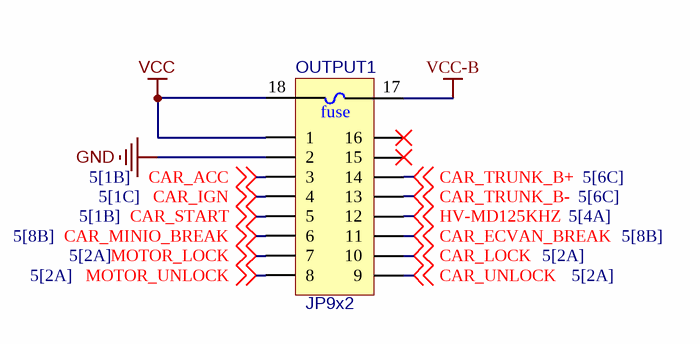
[diagram p3: Connector.SchDoc]

### Parts
OUTPUT1  JP9x2  [9x2_JP200]

### Nets
GND: OUTPUT1.2
VCC: OUTPUT1.1 OUTPUT1.18
VCC-B: OUTPUT1.17
CAR_ACC: OUTPUT1.3 ; off-sheet CAR_ACC
CAR_ECVAN_BREAK: OUTPUT1.11 ; off-sheet CAR_ECVAN_BREAK
CAR_IGN: OUTPUT1.4 ; off-sheet CAR_IGN
CAR_LOCK: OUTPUT1.10 ; off-sheet CAR_LOCK
CAR_MINIO_BREAK: OUTPUT1.6 ; off-sheet CAR_MINIO_BREAK
CAR_START: OUTPUT1.5 ; off-sheet CAR_START
CAR_TRUNK_B+: OUTPUT1.14 ; off-sheet CAR_TRUNK_B+
CAR_TRUNK_B-: OUTPUT1.13 ; off-sheet CAR_TRUNK_B-
CAR_UNLOCK: OUTPUT1.9 ; off-sheet CAR_UNLOCK
HV-MD125KHZ: OUTPUT1.12 ; off-sheet HV-MD125KHZ
MOTOR_LOCK: OUTPUT1.7 ; off-sheet MOTOR_LOCK
MOTOR_UNLOCK: OUTPUT1.8 ; off-sheet MOTOR_UNLOCK

Not connected (* = marked no-connect by the designer): OUTPUT1 15* 16*

### Notes on the sheet
- Author:
- Title:
- Size:
- A4
- Project:
- Approved:
- Revision:
- Modified Date:
- CONFIDENTIAL
- Date:
- SW Version:
- (in symbol JP9x2_1) fuse

### Library data of the parts
OUTPUT1 = JP9x2_1: WR-PHD 2.54 mm Dual Socket Header; Manufacturer: W¨¹rth Elektronik eiSos GmbH; partNo: 61301821821; ComponentLink1 Description: Manufacturer; ComponentLink2 Description: Datasheet; NoPins: 18; Created Date: 29 March 2013; ComponentLink1URL: http://www.we-online.com; ComponentLink2URL: http://katalog.we-online.de/em/datasheet/6130xx21821.pdf; Created by: Karrer Zheng

## Nets that join several sheets
+3.3: Voltage Source (C3.1 C4.1 TP1.1 U1.5), Micro Controller (16 pins), Peripheral (15 pins)
+5: Voltage Source (9 pins), Peripheral (R14.1)
GND: Voltage Source (11 pins), Micro Controller (16 pins), Peripheral (35 pins), Connector (OUTPUT1.2)
VCC: Peripheral (9 pins), Connector (OUTPUT1.1 OUTPUT1.18)
VCC-B: Voltage Source (D1.2), Peripheral (8 pins), Connector (OUTPUT1.17)
BUTTON: Micro Controller (U4.4), Peripheral (C21.2 R12.2 S1.1 TP7.1)
CAR_ACC: Peripheral (D6.2 J2.3), Connector (OUTPUT1.3)
CAR_ECVAN_BREAK: Peripheral (R20.2), Connector (OUTPUT1.11)
CAR_IGN: Peripheral (D9.2 J4.3), Connector (OUTPUT1.4)
CAR_LOCK: Peripheral (RL1.2), Connector (OUTPUT1.10)
CAR_MINIO_BREAK: Peripheral (D7.1), Connector (OUTPUT1.6)
CAR_START: Peripheral (D8.2 J3.3), Connector (OUTPUT1.5)
CAR_TRUNK_B+: Peripheral (U6.7 U6.8), Connector (OUTPUT1.14)
CAR_TRUNK_B-: Peripheral (U6.5 U6.6), Connector (OUTPUT1.13)
CAR_UNLOCK: Peripheral (RL2.2), Connector (OUTPUT1.9)
CLK: Micro Controller (U4.12), Peripheral (H2.4)
CS2: Micro Controller (U4.16), Peripheral (H2.5)
DATA_SYN480R: Micro Controller (U4.10), Peripheral (H4.2 TP8.1 U5.5)
HC595-CLK: Micro Controller (R9.1 U4.15), Peripheral (U7.11)
HC595-DATA: Micro Controller (R8.1 U4.14), Peripheral (U7.14)
HC595-ENABLE: Micro Controller (R7.1 U4.8), Peripheral (U7.13)
HC595-LATCH: Micro Controller (U4.27), Peripheral (U7.12)
HV-MD125KHZ: Peripheral (J1.3 R14.2), Connector (OUTPUT1.12)
LV-MD125KHZ: Micro Controller (U4.28), Peripheral (J1.2 R15.2)
MCU_ECVAN_BREAK: Micro Controller (U4.9), Peripheral (C24.2 D5.3 R20.1 R22.2)
MCU_EVAN-EMN: Micro Controller (R10.1 U4.6), Peripheral (H3.1 R25.2)
MCU_MINIO_BREAK: Micro Controller (U4.5), Peripheral (D7.2 R26.2)
MOSI: Micro Controller (U4.13), Peripheral (H2.3)
MOTOR_LOCK: Peripheral (RL1.1), Connector (OUTPUT1.7)
MOTOR_UNLOCK: Peripheral (RL2.1), Connector (OUTPUT1.8)